# Altium schematic sheet Nolia LCD.SchDoc
size A
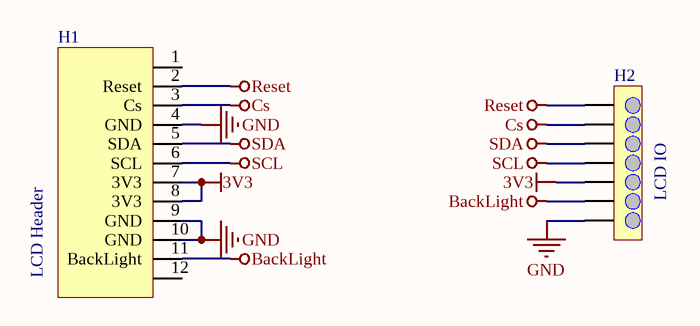
[diagram p0: Nolia LCD.SchDoc]

## Parts
H1  LCD Header 12*1  [LCD Header - duplicate]  (value not drawn)
H2  LCD IO  [HEADER 7X1]

## Nets
3V3: H1.7(3V3) H1.8(3V3) H2.3(H)
BackLight: H1.11(BackLight) H2.2(H)
Cs: H1.3(Cs) H2.6(H)
GND: H1.4(GND) H1.9(GND) H1.10(GND) H2.1(H)
Reset: H1.2(Reset) H2.7(H)
SCL: H1.6(SCL) H2.4(H)
SDA: H1.5(SDA) H2.5(H)

Not connected (* = marked no-connect by the designer): H1 1 12

## Notes on the sheet
- (in symbol LCD Header 12*1) LCD Header

## Library data of the parts
H2 = HEDER 7PIN